# EAGLE schematic Motherboard (EAGLE 9.6.2)

## Sheet 1 of 2
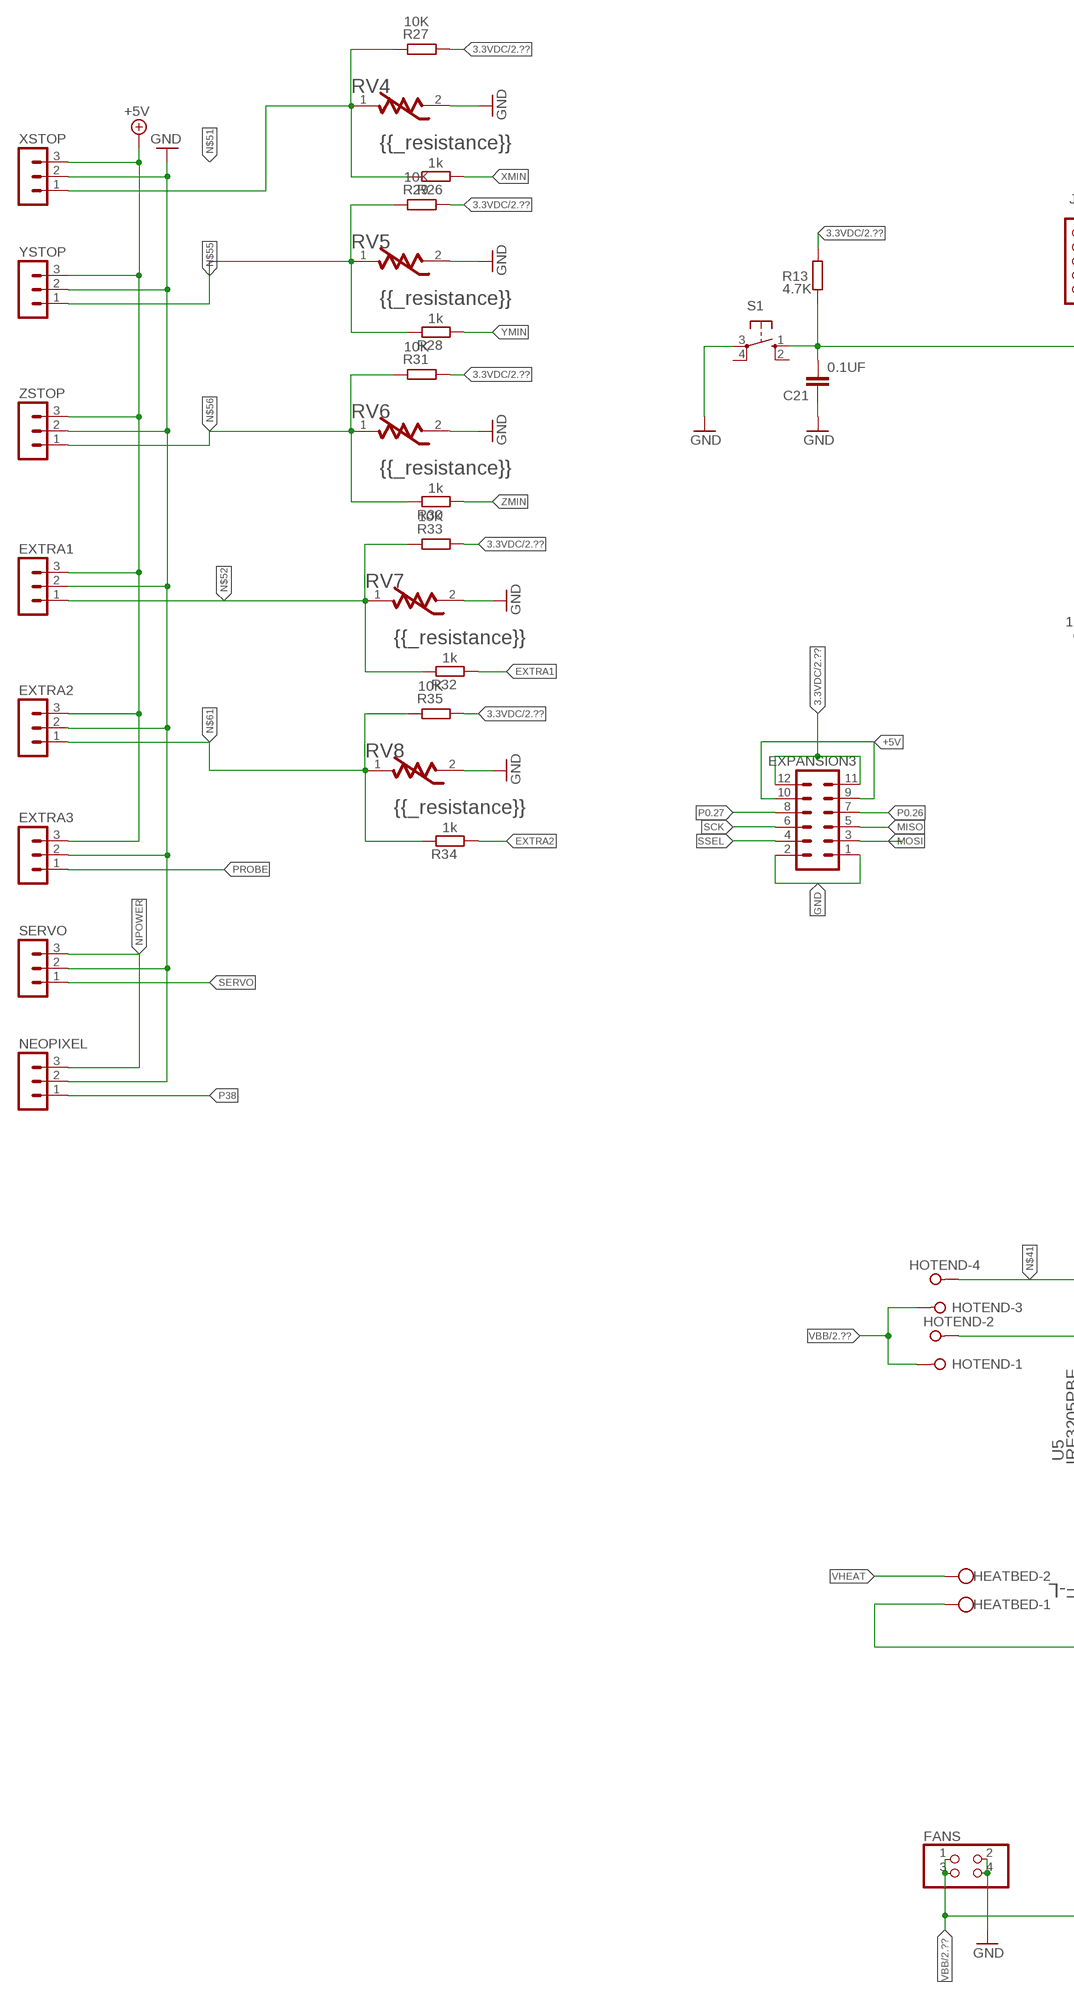
[diagram p0: schematic, sheet 1, part 1 of 2]
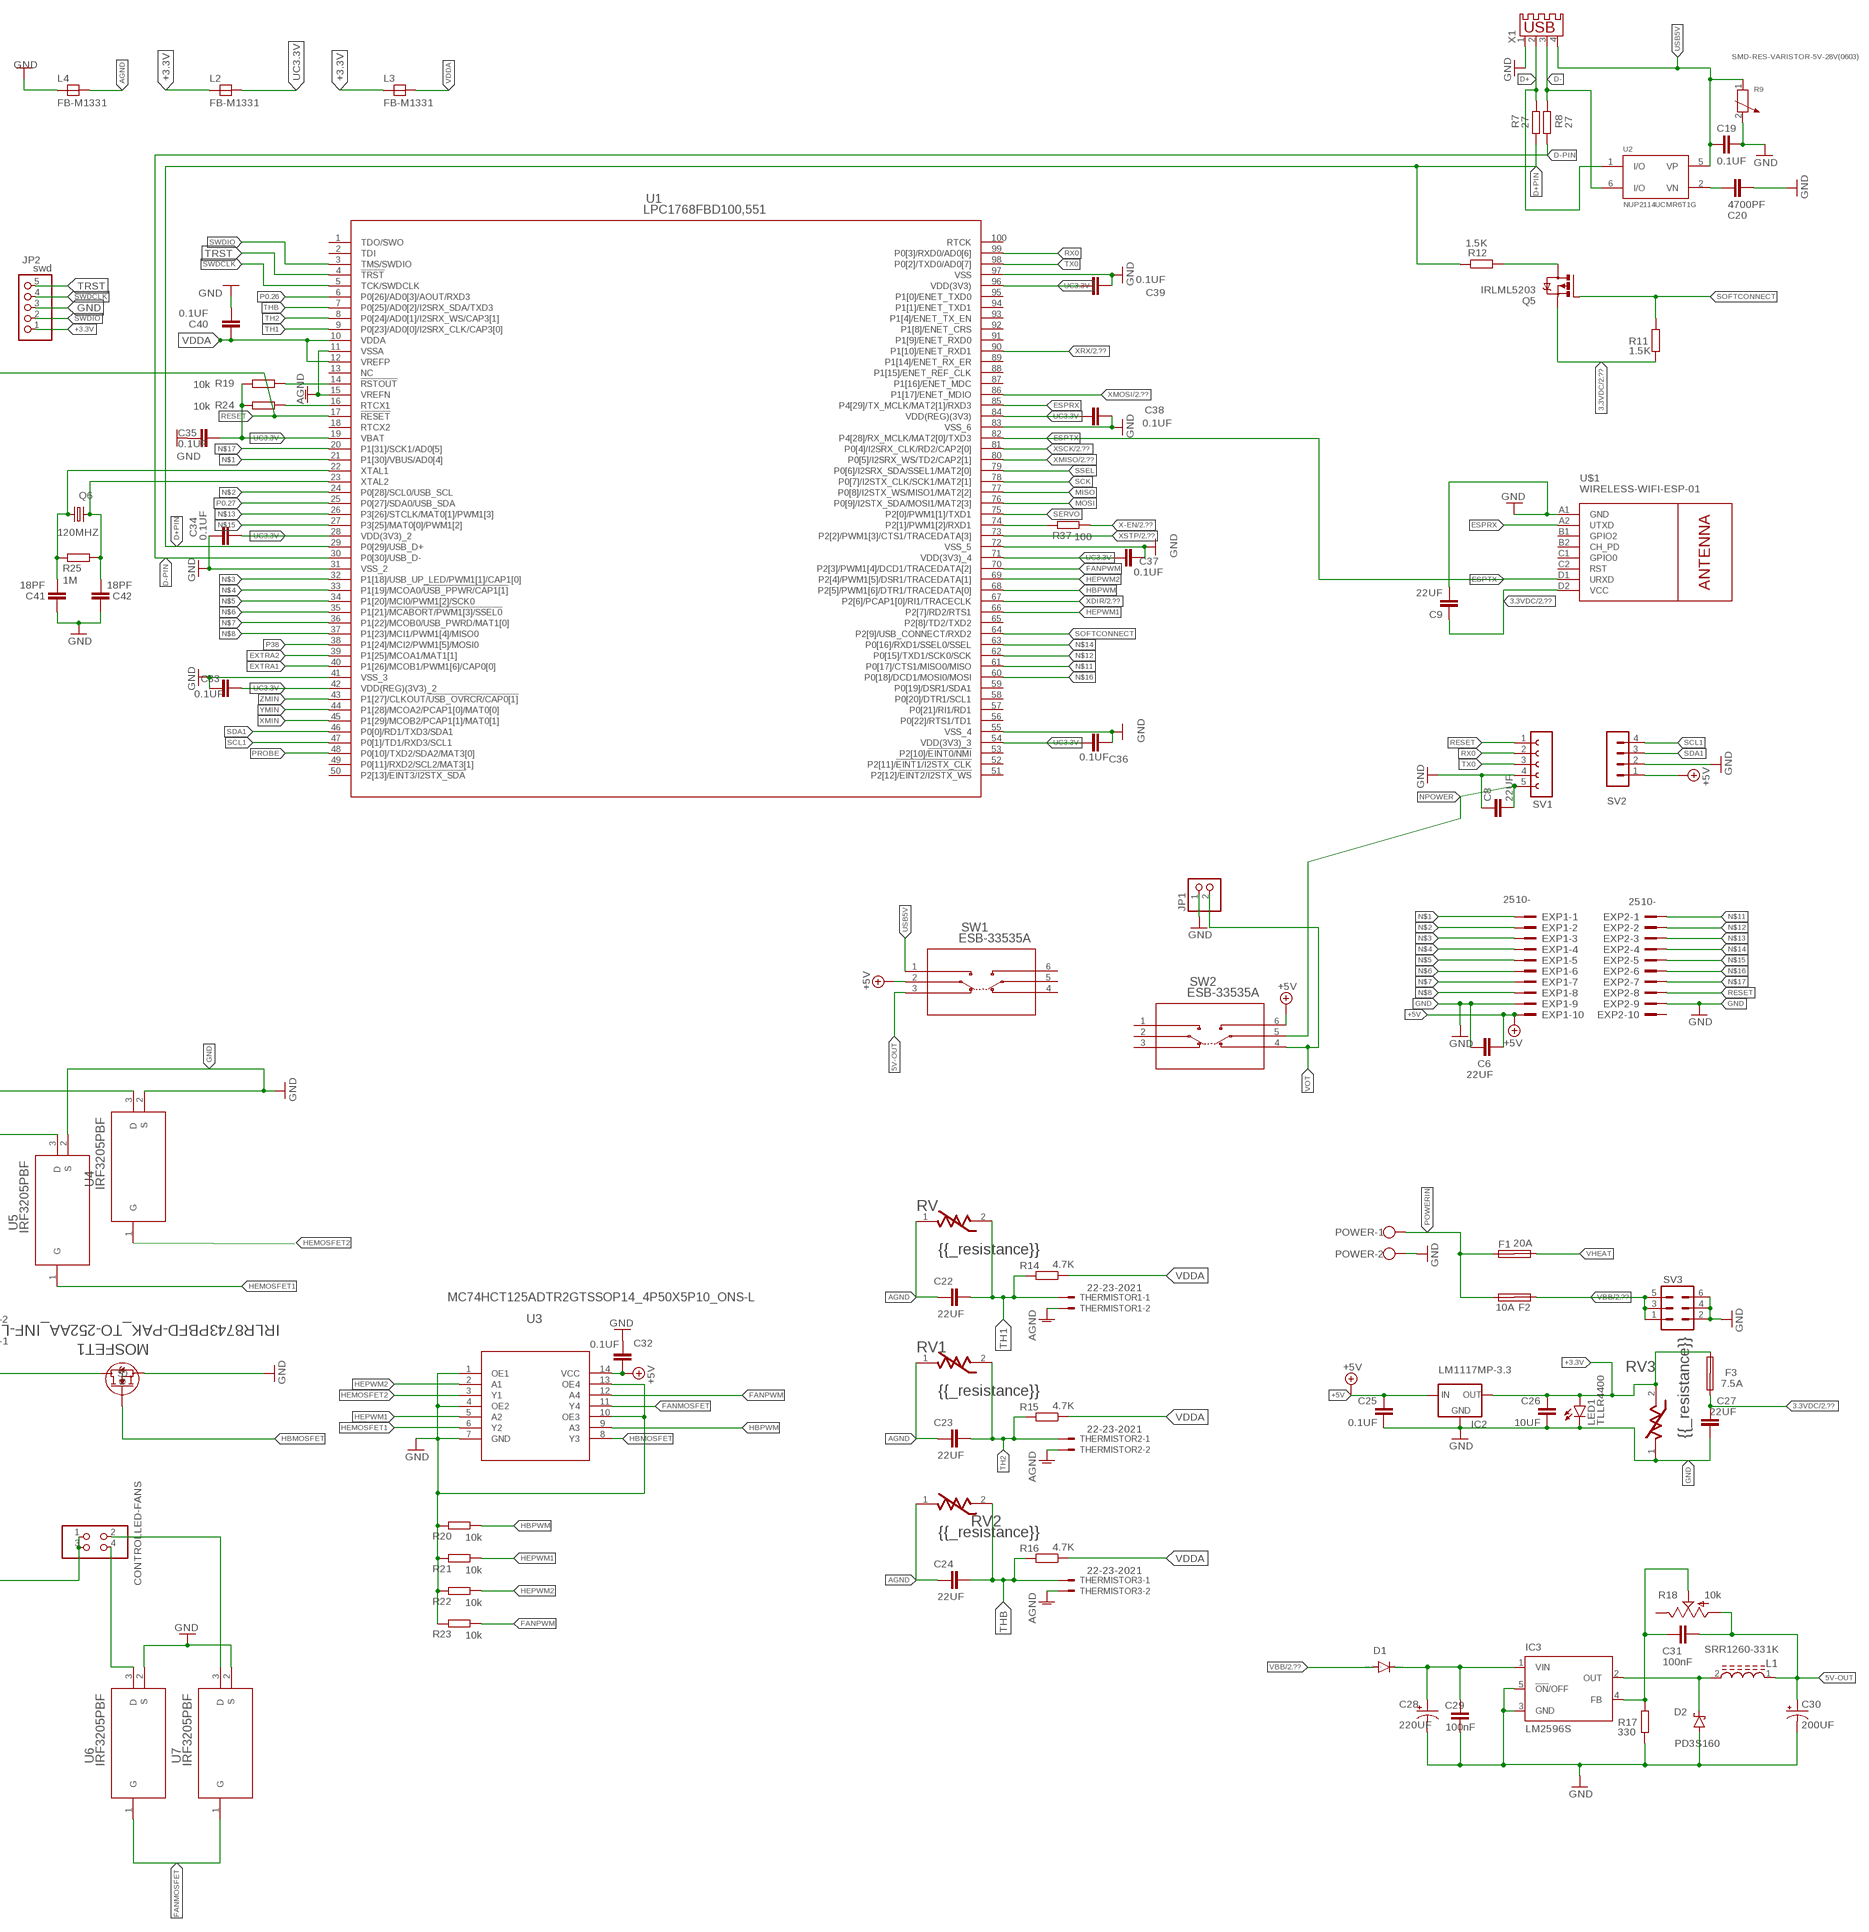
[diagram p1: schematic, sheet 1, part 2 of 2]

### Parts
C6  22UF  C-EUC0805  [C0805]
C8  22UF  C-EUC0805  [C0805]
C9  22UF  C-EUC0805  [C0805]
C19  0.1UF  C-EUC0805  [C0805]
C20  4700PF  C-EUC0805  [C0805]
C21  0.1UF  C-EUC0805  [C0805]
C22  22UF  C-EUC0805  [C0805]
C23  22UF  C-EUC0805  [C0805]
C24  22UF  C-EUC0805  [C0805]
C25  0.1UF  C-EUC0805  [C0805]
C26  10UF  C-EUC0805  [C0805]
C27  22UF  C-EUC0805  [C0805]
C28  220UF  CPOL-USE5-10.5  [E5-10,5]
C29  100nF  C-EUC0805  [C0805]
C30  200UF  CPOL-USE5-10.5  [E5-10,5]
C31  100nF  C-EUC0805  [C0805]
C32  0.1UF  C-EUC0805  [C0805]
C33  0.1UF  C-EUC0805  [C0805]
C34  0.1UF  C-EUC0805  [C0805]
C35  0.1UF  C-EUC0805  [C0805]
C36  0.1UF  C-EUC0805  [C0805]
C37  0.1UF  C-EUC0805  [C0805]
C38  0.1UF  C-EUC0805  [C0805]
C39  0.1UF  C-EUC0805  [C0805]
C40  0.1UF  C-EUC0805  [C0805]
C41  18PF  C-EUC0805  [C0805]
C42  18PF  C-EUC0805  [C0805]
CONTROLLED-FANS  PINHD-2X2  [2X02]
D1  DIODE-DO214AA  [DO214AA]
D2  PD3S160  [POWERDI323]
EXP1  2510-  [PAK100/2500-10]
EXP2  2510-  [PAK100/2500-10]
EXPANSION3  MA06-2  [MA06-2]
EXTRA1  MA03-1  [MA03-1]
EXTRA2  MA03-1  [MA03-1]
EXTRA3  MA03-1  [MA03-1]
F1  20A  SHK20Q  [SHK20Q]
F2  10A  SHK20Q  [SHK20Q]
F3  7.5A  SHK20Q  [SHK20Q]
FANS  PINHD-2X2  [2X02]
HEATBED  W237-102  [W237-102]
HOTEND  W237-04P  [W237-4P]
IC2  LM1117MP-3.3  [SOT223]
IC3  LM2596S  [TO263-5]
JP1  PINHD-1X2  [1X02]
JP2  swd  PINHD-1X5  [1X05]
L1  SRR1260-331K  [INDP125125X600N]
L2  FB-M1331  [M1331]
L3  FB-M1331  [M1331]
L4  FB-M1331  [M1331]
LED1  TLLR4400  [LED3MM]
MOSFET1  IRLR8743PBFD-PAK_TO-252AA_INF-L  [D-PAK_TO-252AA_INF-L]
NEOPIXEL  MA03-1  [MA03-1]
POWER  W237-102  [W237-102]
Q5  IRLML5203  [MICRO3]
Q6  120MHZ  CRYSTALHC49S  [HC49/S]
R7  27  R-EU_R0805  [R0805]
R8  27  R-EU_R0805  [R0805]
R9  SMD-RES-VARISTOR-5V-28V(0603)  [R0603]
R11  1.5K  R-EU_R0805  [R0805]
R12  1.5K  R-EU_R0805  [R0805]
R13  4.7K  R-EU_R0805  [R0805]
R14  4.7K  R-EU_R0805  [R0805]
R15  4.7K  R-EU_R0805  [R0805]
R16  4.7K  R-EU_R0805  [R0805]
R17  330  R-EU_R0805  [R0805]
R18  10k  TRIM_US-B64Y  [B64Y]
R19  10k  R-EU_R0805  [R0805]
R20  10k  R-EU_R0805  [R0805]
R21  10k  R-EU_R0805  [R0805]
R22  10k  R-EU_R0805  [R0805]
R23  10k  R-EU_R0805  [R0805]
R24  10k  R-EU_R0805  [R0805]
R25  1M  R-EU_R0805  [R0805]
R26  1k  R-EU_R0805  [R0805]
R27  10K  R-EU_R0805  [R0805]
R28  1k  R-EU_R0805  [R0805]
R29  10K  R-EU_R0805  [R0805]
R30  1k  R-EU_R0805  [R0805]
R31  10K  R-EU_R0805  [R0805]
R32  1k  R-EU_R0805  [R0805]
R33  10K  R-EU_R0805  [R0805]
R34  1k  R-EU_R0805  [R0805]
R35  10K  R-EU_R0805  [R0805]
R37  100  R-EU_R0805  [R0805]
RV  BOURNS_INC._CG0603MLC-3.3LEBOURNS_INC._CG0603MLC-3.3LE_0_1  [BOURNS_INC._CG0603MLC-3.3LE_1]
RV1  BOURNS_INC._CG0603MLC-3.3LEBOURNS_INC._CG0603MLC-3.3LE_0_1  [BOURNS_INC._CG0603MLC-3.3LE_1]
RV2  BOURNS_INC._CG0603MLC-3.3LEBOURNS_INC._CG0603MLC-3.3LE_0_1  [BOURNS_INC._CG0603MLC-3.3LE_1]
RV3  BOURNS_INC._CG0603MLC-3.3LEBOURNS_INC._CG0603MLC-3.3LE_0_1  [BOURNS_INC._CG0603MLC-3.3LE_1]
RV4  BOURNS_INC._CG0603MLC-3.3LEBOURNS_INC._CG0603MLC-3.3LE_0_1  [BOURNS_INC._CG0603MLC-3.3LE_1]
RV5  BOURNS_INC._CG0603MLC-3.3LEBOURNS_INC._CG0603MLC-3.3LE_0_1  [BOURNS_INC._CG0603MLC-3.3LE_1]
RV6  BOURNS_INC._CG0603MLC-3.3LEBOURNS_INC._CG0603MLC-3.3LE_0_1  [BOURNS_INC._CG0603MLC-3.3LE_1]
RV7  BOURNS_INC._CG0603MLC-3.3LEBOURNS_INC._CG0603MLC-3.3LE_0_1  [BOURNS_INC._CG0603MLC-3.3LE_1]
RV8  BOURNS_INC._CG0603MLC-3.3LEBOURNS_INC._CG0603MLC-3.3LE_0_1  [BOURNS_INC._CG0603MLC-3.3LE_1]
S1  10-XX  [B3F-10XX]
SERVO  MA03-1  [MA03-1]
SV1  FE05-1  [FE05-1]
SV2  MA04-1  [MA04-1]
SV3  MA03-2  [MA03-2]
SW1  ESB-33535A  [ESB335_PAN]
SW2  ESB-33535A  [ESB335_PAN]
THERMISTOR1  22-23-2021  [22-23-2021]
THERMISTOR2  22-23-2021  [22-23-2021]
THERMISTOR3  22-23-2021  [22-23-2021]
U1  LPC1768FBD100,551  [LQFP100_14X14_NXP]
U2  NUP2114UCMR6T1G  [SOP95P275X110-6N]
U3  MC74HCT125ADTR2GTSSOP14_4P50X5P10_ONS-L  [TSSOP14_4P50X5P10_ONS-L]
U4  IRF3205PBF  [PG-TO220-3_INF]
U5  IRF3205PBF  [PG-TO220-3_INF]
U6  IRF3205PBF  [PG-TO220-3_INF]
U7  IRF3205PBF  [PG-TO220-3_INF]
U$1  WIRELESS-WIFI-ESP-01  [WIRELESS-WIFI-ESP-01]
X1  USB-A003  [USB-A003]
XSTOP  MA03-1  [MA03-1]
YSTOP  MA03-1  [MA03-1]
ZSTOP  MA03-1  [MA03-1]

### Nets
3.3VDC: C9.1 C27.1 EXPANSION3.11 EXPANSION3.12 F3.1A Q5.2(S) R11.2 R13.1 R27.2 R29.2 R31.2 R33.2 R35.2 U$1.D2(VCC) ; also sheet 2
5V-OUT: C30.+ C31.2 L1.1 R18.A SW1.3
+3.3V: C26.1 F3.2A IC2.2(OUT) IC2.4(OUT) JP2.1 L2.1 L3.1 LED1.A RV3.2
+5V: C6.1 C25.1 C32.2 EXP1.10 EXPANSION3.9 EXPANSION3.10 EXTRA1.3 EXTRA2.3 EXTRA3.3 IC2.3(IN) SV2.1 SW1.2 SW2.6 U3.14(VCC) XSTOP.3 YSTOP.3 ZSTOP.3
AGND: C22.1 C23.1 C24.1 L4.2 RV1.1 RV2.1 RV.1 THERMISTOR1.2 THERMISTOR2.2 THERMISTOR3.2 U1.11(VSSA) U1.15(VREFN)
D+: R7.2 U2.1(I/O) X1.2
D+PIN: R7.1 R12.1 U1.29(P0[29]/USB_D+)
D-: R8.2 U2.6(I/O) X1.3
D-PIN: R8.1 U1.30(P0[30]/USB_D-)
ESPRX: U1.85(P4[29]/TX_MCLK/MAT2[1]/RXD3) U$1.A2(UTXD)
ESPTX: U1.82(P4[28]/RX_MCLK/MAT2[0]/TXD3) U$1.D1(URXD)
EXTRA1: R32.2 U1.40(P1[26]/MCOB1/PWM1[6]/CAP0[0])
EXTRA2: R34.2 U1.39(P1[25]/MCOA1/MAT1[1])
FANMOSFET: U3.11(Y4) U6.1(G) U7.1(G)
FANPWM: R23.1 U1.70(P2[3]/PWM1[4]/DCD1/TRACEDATA[2]) U3.12(A4)
GND: C6.2 C8.1 C9.2 C19.1 C20.1 C21.2 C25.2 C26.2 C27.2 C28.- C29.2 C30.- C32.1 C33.1 C34.1 C35.1 C36.1 C37.1 C38.1 C39.1 C40.2 C41.1 C42.1 D2.A EXP1.9 EXP2.9 EXPANSION3.1 EXPANSION3.2 EXTRA1.2 EXTRA2.2 EXTRA3.2 FANS.2 FANS.4 IC2.1(GND) IC3.3(GND) IC3.5(!ON!/OFF) JP1.1 JP2.3 L4.1 LED1.K(C) MOSFET1.3(S) NEOPIXEL.2 POWER.2 R9.2 R17.2 R20.2 R21.2 R22.2 R23.2 RV3.1 RV4.2 RV5.2 RV6.2 RV7.2 RV8.2 S1.3(P) SERVO.2 SV1.4 SV2.2 SV3.2 SV3.4 SV3.6 U1.31(VSS_2) U1.41(VSS_3) U1.55(VSS_4) U1.72(VSS_5) U1.83(VSS_6) U1.97(VSS) U3.1(OE1) U3.4(OE2) U3.7(GND) U3.10(OE3) U3.13(OE4) U4.2(S) U5.2(S) U6.2(S) U7.2(S) U$1.A1(GND) X1.1 XSTOP.2 YSTOP.2 ZSTOP.2 ; also sheet 2
HBMOSFET: MOSFET1.1(G) U3.8(Y3)
HBPWM: R20.1 U1.68(P2[5]/PWM1[6]/DTR1/TRACEDATA[0]) U3.9(A3)
HEMOSFET1: U3.6(Y2) U5.1(G)
HEMOSFET2: U3.3(Y1) U4.1(G)
HEPWM1: R21.1 U1.66(P2[7]/RD2/RTS1) U3.5(A2)
HEPWM2: R22.1 U1.69(P2[4]/PWM1[5]/DSR1/TRACEDATA[1]) U3.2(A1)
MISO: EXPANSION3.5 U1.77(P0[8]/I2STX_WS/MISO1/MAT2[2])
MOSI: EXPANSION3.3 U1.76(P0[9]/I2STX_SDA/MOSI1/MAT2[3])
N$1: EXP1.1 U1.21(P1[30]/VBUS/AD0[4])
N$2: EXP1.2 U1.24(P0[28]/SCL0/USB_SCL)
N$3: EXP1.3 U1.32(P1[18]/USB_UP_LED/PWM1[1]/CAP1[0])
N$4: EXP1.4 U1.33(P1[19]/MCOA0/!USB_PPWR/CAP1[1])
N$5: EXP1.5 U1.34(P1[20]/MCI0/PWM1[2]/SCK0)
N$6: EXP1.6 U1.35(P1[21]/!MCABORT/PWM1[3]/SSEL0)
N$7: EXP1.7 U1.36(P1[22]/MCOB0/USB_PWRD/MAT1[0])
N$8: EXP1.8 U1.37(P1[23]/MCI1/PWM1[4]/MISO0)
N$11: EXP2.1 U1.61(P0[17]/CTS1/MISO0/MISO)
N$12: EXP2.2 U1.62(P0[15]/TXD1/SCK0/SCK)
N$13: EXP2.3 U1.26(P3[26]/STCLK/MAT0[1]/PWM1[3])
N$14: EXP2.4 U1.63(P0[16]/RXD1/SSEL0/SSEL)
N$15: EXP2.5 U1.27(P3[25]/MAT0[0]/PWM1[2])
N$16: EXP2.6 U1.60(P0[18]/DCD1/MOSI0/MOSI)
N$17: EXP2.7 U1.20(P1[31]/SCK1/AD0[5])
N$22: R37.2 U1.74(P2[1]/PWM1[2]/RXD1)
N$34: C20.2 U2.2(VN)
N$35: HEATBED.1 MOSFET1.2(D)
N$36: Q5.3(D) R12.2
N$37: C31.1 IC3.4(FB) R17.1 R18.S
N$38: C28.+ C29.1 D1.C IC3.1(VIN)
N$39: D2.C IC3.2(OUT) L1.2
N$40: CONTROLLED-FANS.4 U6.3(D)
N$41: HOTEND.4 U4.3(D)
N$42: HOTEND.2 U5.3(D)
N$43: CONTROLLED-FANS.2 U7.3(D)
N$44: R19.1 U1.14(!RSTOUT)
N$45: R24.1 U1.16(RTCX1)
N$46: C41.2 Q6.1 R25.2 U1.22(XTAL1)
N$47: C42.2 Q6.2 R25.1 U1.23(XTAL2)
N$51: R26.1 R27.1 RV4.1 XSTOP.1
N$52: EXTRA1.1 R32.1 R33.1 RV7.1
N$55: R28.1 R29.1 RV5.1 YSTOP.1
N$56: R30.1 R31.1 RV6.1 ZSTOP.1
N$61: EXTRA2.1 R34.1 R35.1 RV8.1
NPOWER: C8.2 NEOPIXEL.3 SERVO.3 SV1.5 SW2.5
P0.26: EXPANSION3.7 U1.6(P0[26]/AD0[3]/AOUT/RXD3)
P0.27: EXPANSION3.8 U1.25(P0[27]/SDA0/USB_SDA)
P38: NEOPIXEL.1 U1.38(P1[24]/MCI2/PWM1[5]/MOSI0)
POWERIN: F1.1A F2.2A POWER.1
PROBE: EXTRA3.1 U1.48(P0[10]/TXD2/SDA2/MAT3[0])
RESET: C21.1 EXP2.8 R13.2 S1.1(S) SV1.1 U1.17(!RESET)
RX0: SV1.2 U1.99(P0[3]/RXD0/AD0[6])
SCK: EXPANSION3.6 U1.78(P0[7]/I2STX_CLK/SCK1/MAT2[1])
SCL1: SV2.4 U1.47(P0[1]/TD1/RXD3/SCL1)
SDA1: SV2.3 U1.46(P0[0]/RD1/TXD3/SDA1)
SERVO: SERVO.1 U1.75(P2[0]/PWM1[1]/TXD1)
SOFTCONNECT: Q5.1(G) R11.1 U1.64(P2[9]/USB_CONNECT/RXD2)
SSEL: EXPANSION3.4 U1.79(P0[6]/I2SRX_SDA/SSEL1/MAT2[0])
SWDCLK: JP2.4 U1.5(TCK/SWDCLK)
SWDIO: JP2.2 U1.3(TMS/SWDIO)
TH1: C22.2 R14.2 RV.2 THERMISTOR1.1 U1.9(P0[23]/AD0[0]/I2SRX_CLK/CAP3[0])
TH2: C23.2 R15.2 RV1.2 THERMISTOR2.1 U1.8(P0[24]/AD0[1]/I2SRX_WS/CAP3[1])
THB: C24.2 R16.2 RV2.2 THERMISTOR3.1 U1.7(P0[25]/AD0[2]/I2SRX_SDA/TXD3)
TRST: JP2.5 U1.4(!TRST)
TX0: SV1.3 U1.98(P0[2]/TXD0/AD0[7])
UC3.3V: C33.2 C34.2 C35.2 C36.2 C37.2 C38.2 C39.2 L2.2 R19.2 R24.2 U1.19(VBAT) U1.28(VDD(3V3)_2) U1.42(VDD(REG)(3V3)_2) U1.54(VDD(3V3)_3) U1.71(VDD(3V3)_4) U1.84(VDD(REG)(3V3)) U1.96(VDD(3V3))
USB5V: C19.2 R9.1 SW1.1 U2.5(VP) X1.4
VBB: CONTROLLED-FANS.1 CONTROLLED-FANS.3 D1.A F2.1A FANS.1 FANS.3 HOTEND.1 HOTEND.3 SV3.1 SV3.3 SV3.5 ; also sheet 2
VDDA: C40.1 L3.2 R14.1 R15.1 R16.1 U1.10(VDDA) U1.12(VREFP)
VHEAT: F1.2A HEATBED.2
VOT: JP1.2 SW2.4
X-EN: R37.1 ; also sheet 2
XDIR: U1.67(P2[6]/PCAP1[0]/RI1/TRACECLK) ; also sheet 2
XMIN: R26.2 U1.45(P1[29]/MCOB2/PCAP1[1]/MAT0[1])
XMISO: U1.80(P0[5]/I2SRX_WS/TD2/CAP2[1]) ; also sheet 2
XMOSI: U1.86(P1[17]/ENET_MDIO) ; also sheet 2
XRX: U1.90(P1[10]/ENET_RXD1) ; also sheet 2
XSCK: U1.81(P0[4]/I2SRX_CLK/RD2/CAP2[0]) ; also sheet 2
XSTP: U1.73(P2[2]/PWM1[3]/CTS1/TRACEDATA[3]) ; also sheet 2
YMIN: R28.2 U1.44(P1[28]/MCOA2/PCAP1[0]/MAT0[0])
ZMIN: R30.2 U1.43(P1[27]/CLKOUT/!USB_OVRCR/CAP0[1])
Unconnected: EXP2.10 F1.1B F1.2B F2.1B F2.2B F3.1B F3.2B R18.E S1.2(S1) S1.4(P1) SW1.4 SW1.5 SW1.6 SW2.1 SW2.2 SW2.3 U1.1(TDO/SWO) U1.2(TDI) U1.13(NC) U1.18(RTCX2) U1.49(P0[11]/RXD2/SCL2/MAT3[1]) U1.50(P2[13]/!EINT3/I2STX_SDA) U1.51(P2[12]/!EINT2/I2STX_WS) U1.52(P2[11]/!EINT1/I2STX_CLK) U1.53(P2[10]/!EINT0/NMI) U1.56(P0[22]/RTS1/TD1) U1.57(P0[21]/RI1/RD1) U1.58(P0[20]/DTR1/SCL1) U1.59(P0[19]/DSR1/SDA1) U1.65(P2[8]/TD2/TXD2) U1.87(P1[16]/ENET_MDC) U1.88(P1[15]/ENET_REF_CLK) U1.89(P1[14]/ENET_RX_ER) U1.91(P1[9]/ENET_RXD0) U1.92(P1[8]/ENET_CRS) U1.93(P1[4]/ENET_TX_EN) U1.94(P1[1]/ENET_TXD1) U1.95(P1[0]/ENET_TXD0) U1.100(RTCK) U$1.B1(GPIO2) U$1.B2(CH_PD) U$1.C1(GPIO0) U$1.C2(RST)

## Sheet 2 of 2
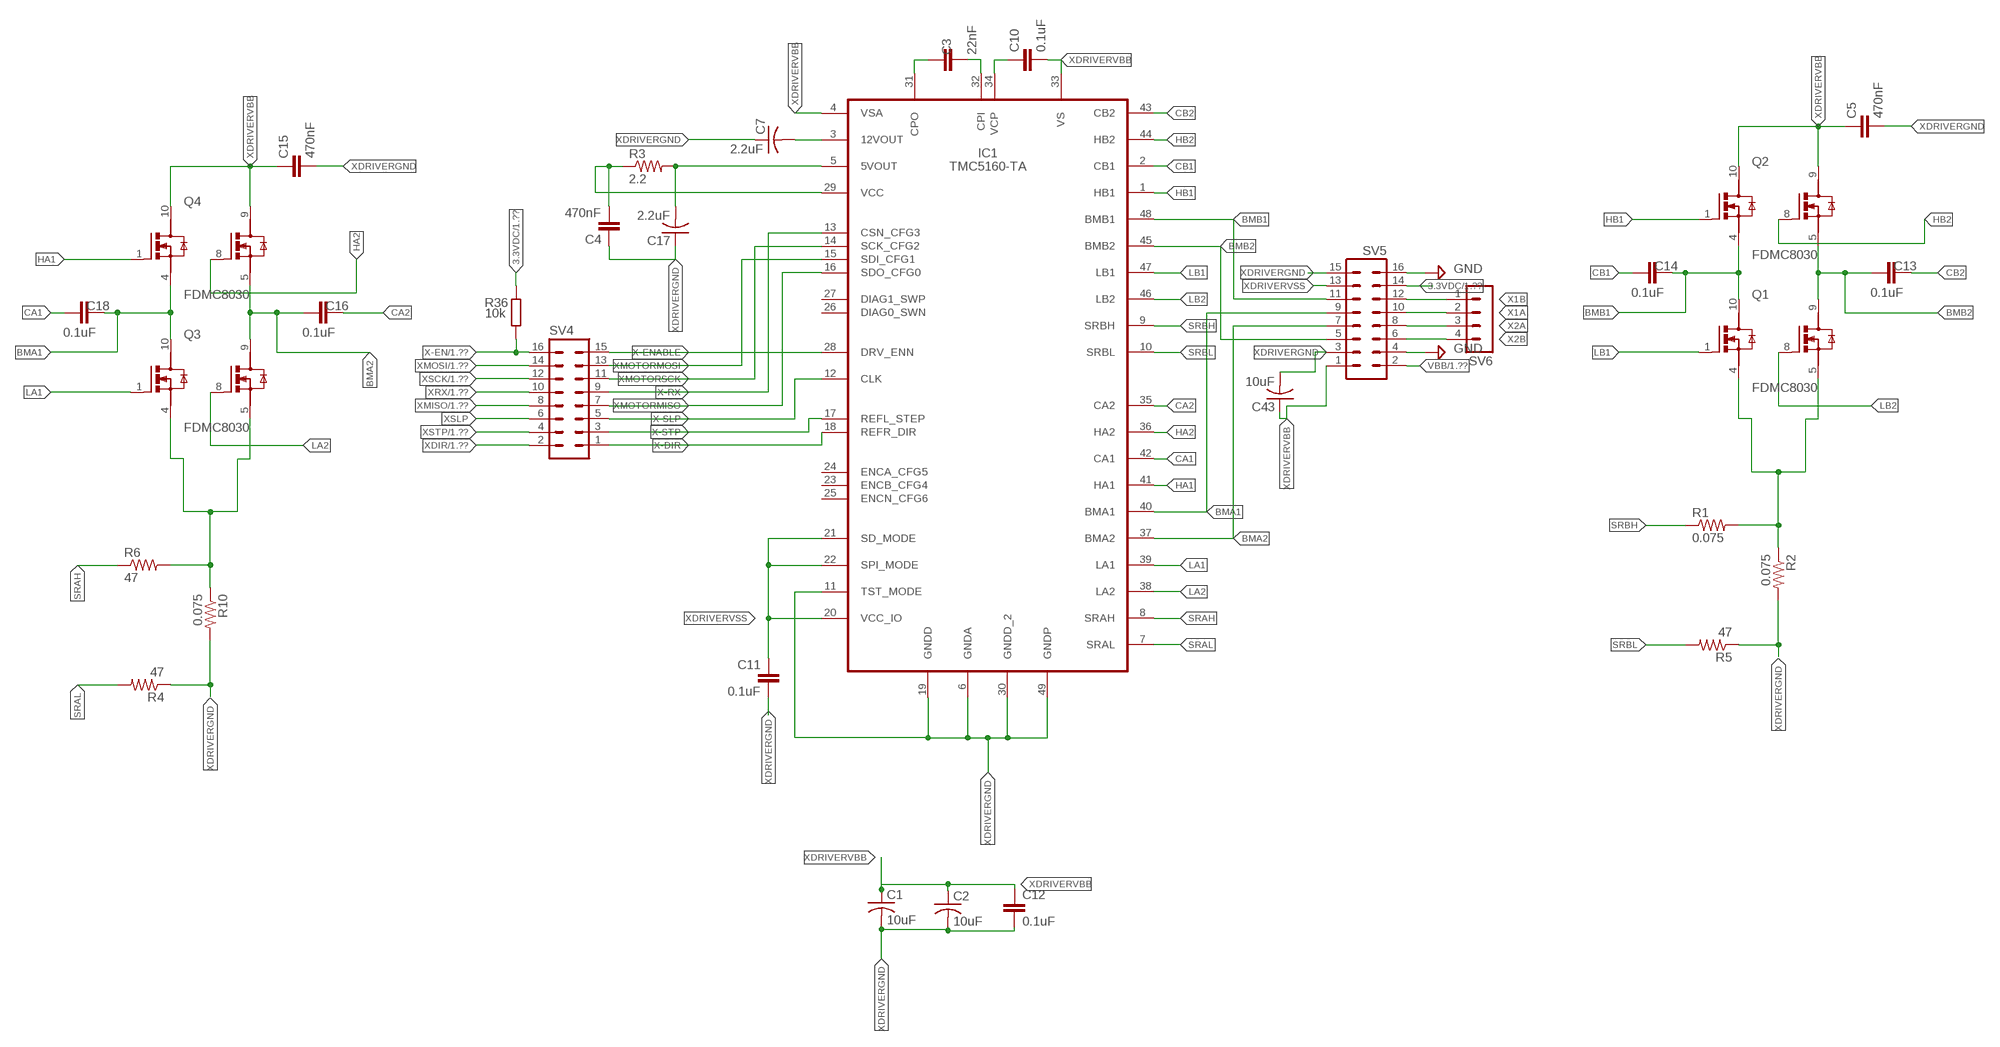
[diagram p2: schematic, sheet 2]

### Parts
C1  10uF  C-USC0805  [C0805]
C2  10uF  C-USC0805  [C0805]
C3  22nF  22NF/22,000PF-0603-50V-10%  [0603]
C4  470nF  470NF-0402-16V-10%  [0402]
C5  470nF  470NF-0402-16V-10%  [0402]
C7  2.2uF  C-USC0402  [C0402]
C10  0.1uF  0.1UF-0402-16V-10%  [0402]
C11  0.1uF  0.1UF-0402-16V-10%  [0402]
C12  0.1uF  0.1UF-0402-16V-10%  [0402]
C13  0.1uF  0.1UF-0402-16V-10%  [0402]
C14  0.1uF  0.1UF-0402-16V-10%  [0402]
C15  470nF  470NF-0402-16V-10%  [0402]
C16  0.1uF  0.1UF-0402-16V-10%  [0402]
C17  2.2uF  C-USC0402  [C0402]
C18  0.1uF  0.1UF-0402-16V-10%  [0402]
C43  10uF  C-USC0805  [C0805]
IC1  TMC5160-TA  [TQFP48-EP]
Q1  FDMC8030  [TRANS_FDMC8030]
Q2  FDMC8030  [TRANS_FDMC8030]
Q3  FDMC8030  [TRANS_FDMC8030]
Q4  FDMC8030  [TRANS_FDMC8030]
R1  0.075  R-US_R1206  [R1206]
R2  0.075  R-US_R1206  [R1206]
R3  2.2  R-US_R0402  [R0402]
R4  47  R-US_R0402  [R0402]
R5  47  R-US_R0402  [R0402]
R6  47  R-US_R0402  [R0402]
R10  0.075  R-US_R1206  [R1206]
R36  10k  R-EU_R0805  [R0805]
SV4  MA08-2  [MA08-2]
SV5  MA08-2  [MA08-2]
SV6  MA04-1  [MA04-1]

### Nets
3.3VDC: R36.1 SV5.14 ; also sheet 1
BMA1: C18.2 IC1.40(BMA1) Q3.10(D1) Q4.4(S1) SV5.9
BMA2: C16.1 IC1.37(BMA2) Q3.9(D2) Q4.5(S2) SV5.7
BMB1: C14.2 IC1.48(BMB1) Q1.10(D1) Q2.4(S1) SV5.11
BMB2: C13.1 IC1.45(BMB2) Q1.9(D2) Q2.5(S2) SV5.5
CA1: C18.1 IC1.42(CA1)
CA2: C16.2 IC1.35(CA2)
CB1: C14.1 IC1.2(CB1)
CB2: C13.2 IC1.43(CB2)
GND: SV5.4 SV5.16 ; also sheet 1
HA1: IC1.41(HA1) Q4.1(G1)
HA2: IC1.36(HA2) Q4.8(G2)
HB1: IC1.1(HB1) Q2.1(G1)
HB2: IC1.44(HB2) Q2.8(G2)
LA1: IC1.39(LA1) Q3.1(G1)
LA2: IC1.38(LA2) Q3.8(G2)
LB1: IC1.47(LB1) Q1.1(G1)
LB2: IC1.46(LB2) Q1.8(G2)
N$9: C10.1 IC1.34(VCP)
N$10: C3.1 IC1.31(CPO)
N$18: C3.2 IC1.32(CPI)
N$19: C7.2 IC1.3(12VOUT)
N$20: C17.2 IC1.5(5VOUT) R3.2
N$21: C4.2 IC1.29(VCC) R3.1
N$32: Q1.4(S1) Q1.5(S2) R1.2 R2.1
N$33: Q3.4(S1) Q3.5(S2) R6.2 R10.1
SRAH: IC1.8(SRAH) R6.1
SRAL: IC1.7(SRAL) R4.2
SRBH: IC1.9(SRBH) R1.1
SRBL: IC1.10(SRBL) R5.2
VBB: SV5.2 ; also sheet 1
X1A: SV5.10 SV6.2
X1B: SV5.12 SV6.1
X2A: SV5.8 SV6.3
X2B: SV5.6 SV6.4
X-DIR: IC1.18(REFR_DIR) SV4.1
X-EN: R36.2 SV4.16 ; also sheet 1
X-ENABLE: IC1.28(DRV_ENN) SV4.15
X-RX: IC1.13(CSN_CFG3) SV4.9
X-SLP: IC1.12(CLK) SV4.5
X-STP: IC1.17(REFL_STEP) SV4.3
XDIR: SV4.2 ; also sheet 1
XDRIVERGND: C1.2 C2.2 C4.1 C5.2 C7.1 C11.2 C12.2 C15.2 C17.1 C43.2 IC1.6(GNDA) IC1.11(TST_MODE) IC1.19(GNDD) IC1.30(GNDD_2) IC1.49(GNDP) R2.2 R4.1 R5.1 R10.2 SV5.3 SV5.15
XDRIVERVBB: C1.1 C2.1 C5.1 C10.2 C12.1 C15.1 C43.1 IC1.4(VSA) IC1.33(VS) Q2.9(D2) Q2.10(D1) Q4.9(D2) Q4.10(D1) SV5.1
XDRIVERVSS: C11.1 IC1.20(VCC_IO) IC1.21(SD_MODE) IC1.22(SPI_MODE) SV5.13
XMISO: SV4.8 ; also sheet 1
XMOSI: SV4.14 ; also sheet 1
XMOTORMISO: IC1.16(SDO_CFG0) SV4.7
XMOTORMOSI: IC1.15(SDI_CFG1) SV4.13
XMOTORSCK: IC1.14(SCK_CFG2) SV4.11
XRX: SV4.10 ; also sheet 1
XSCK: SV4.12 ; also sheet 1
XSLP: SV4.6
XSTP: SV4.4 ; also sheet 1
Unconnected: IC1.23(ENCB_CFG4) IC1.24(ENCA_CFG5) IC1.25(ENCN_CFG6) IC1.26(DIAG0_SWN) IC1.27(DIAG1_SWP)

## Library data of the parts
C1 C2 C7 C17 C43 = adafruit:C-US: CAPACITOR, American symbol
C3 = SparkFun-Capacitors:22NF/22,000PF: 0.022uF/22nF/22,000pF ceramic capacitors A capacitor is a passive two-terminal electrical component used to store electrical energy temporarily in an electric field.; PROD_ID: CAP-07885
C4 C5 C15 = SparkFun-Capacitors:470NF: 0.47uF/470nF ceramic capacitors A capacitor is a passive two-terminal electrical component used to store electrical energy temporarily in an electric field.; PROD_ID: CAP-09041
C6 C8 C9 C19-C27 C29 C31-C42 = rcl:C-EU: CAPACITOR, European symbol; SPICEPREFIX: C
C10-C14 C16 C18 = SparkFun-Capacitors:0.1UF: 0.1µF ceramic capacitors A capacitor is a passive two-terminal electrical component used to store electrical energy temporarily in an electric field.; PROD_ID: CAP-12416
C28 C30 = rcl:CPOL-US: POLARIZED CAPACITOR, American symbol; SPICEPREFIX: C
CONTROLLED-FANS FANS = pinhead:PINHD-2X2: PIN HEADER
D1 = diode:DIODE-: DIODE
D2 = diode:PD3S160: 1.0A SURFACE MOUNT SCHOTTKY BARRIER RECTIFIER POWERDI ® 323 Source: http://www.diodes.com/datasheets/ds30899.pdf
EXP1 EXP2 = con-3m:2510-: 3M (TM) Pak 100 4-Wall Header Source: 3M; MF: 3M; MPN: 2510-6002UB; OC_FARNELL: 9838244; OC_NEWARK: 46F4725
EXPANSION3 = con-lstb:MA06-2: PIN HEADER; OC_FARNELL: unknown; OC_NEWARK: unknown
EXTRA1-EXTRA3 NEOPIXEL SERVO XSTOP YSTOP ZSTOP = con-lstb:MA03-1: PIN HEADER; OC_FARNELL: unknown; OC_NEWARK: unknown
F1-F3 = fuse:SHK20Q: FUSE HOLDER 5 x 20 mm, SH contact, E1207 Buerklin 64G6061; OC_FARNELL: unknown; OC_NEWARK: unknown
HEATBED POWER = con-wago-500:W237-102: WAGO SCREW CLAMP; MPN: 237-102; OC_FARNELL: unknown; OC_NEWARK: 70K9898
HOTEND = con-wago-508:W237-04P: WAGO SREW CLAMP; OC_FARNELL: unknown; OC_NEWARK: unknown
IC1 = TMC5160-TA:TMC5160-TA: Universal high voltage controller for two-phase bipolar stepper motor. TQFP48-EP; AVAILABILITY: Unavailable; DESCRIPTION: Bipolar Motor Driver BCD MOS External Power MOSFETs SPI, Step/Direction 48-TQFP-EP _7x7_; MF: Trinamic Motion; MP: TMC5160-TA; PACKAGE: TQFP-48 Trinamic Motion; PRICE: None
IC2 = lm1117_10:LM1117?-*: 800mA Low-Dropout Linear Regulator Source: http://www.ti.com/lit/ds/symlink/lm1117-n.pdf; MF: Texas Instruments; MPN: LM1117MP-3.3; OC_FARNELL: 9778195; OC_NEWARK: 28X3416
IC3 = national-semiconductor:LM2596: SIMPLE SWITCHER® Power Converter 150 kHz 3A Step-Down Voltage Regulator Source: http://www.national.com/ds/LM/LM2596.pdf; MF: NATIONAL SEMICONDUCTOR; MPN: LM2596S-ADJ/NOPB; OC_FARNELL: 9494367; OC_NEWARK: 41K3842
JP1 = pinhead:PINHD-1X2: PIN HEADER
JP2 = pinhead:PINHD-1X5: PIN HEADER
L1 = SRR1260-331K:SRR1260-331K: Inductor Power Shielded Wirewound 33uH 20% 100KHz 27Q-Factor Ferrite 3A 60mOhm DCR T/R Buy Part <https://snapeda.com/parts/SRR1260-331K/Bourns/view-part/?ref=eda>; AVAILABILITY: Good; DESCRIPTION: 330µH Shielded Wirewound Inductor 1.15A 580mOhm Max Nonstandard; DIGIKEY-PURCHASE-URL: https://snapeda.com/shop?store=DigiKey&id=317881; MF: Bourns; MOUSER-PURCHASE-URL: https://snapeda.com/shop?store=Mouser&id=317881; MP: SRR1260-331K; PACKAGE: Nonstandard Bourns; PRICE: None
L2-L4 = inductors-jwmiller:FB: FERRITE BEAD
LED1 = led:TLLR4400: Low Current (2mA) LED 3 mm Tinted Diffused Package color RED Source: Data sheet <http://www.farnell.com/datasheets/391100.pdf>; MF: VISHAY SEMICONDUCTOR; OC_FARNELL: 1612437
MOSFET1 = IRLR8743:IRLR8743PBF; BUILT_BY: EMA_Cory; COPYRIGHT: Copyright (C) 2018 Accelerated Designs. All rights reserved; DATASHEET: https://www.infineon.com/dgdl/irlr8743pbf.pdf?fileId=5546d462533600a4015356719c7e26ff; MANUFACTURER_PART_NUMBER: IRLR8743PBF; SOURCELIBRARY: Infineon_2020-07-22; VENDOR: Infineon
Q1-Q4 = FDMC8030:FDMC8030: Dual N-Channel Power Trench® MOSFET 40 V, 12 A, 10 mΩ; AVAILABILITY: Unavailable; DESCRIPTION: Mosfet Array 2 N-Channel _Dual_ 40V 12A 800mW Surface Mount 8-Power33 _3x3_; MF: ON Semiconductor; MP: FDMC8030; PACKAGE: PowerWDFN-8 ON Semiconductor; PRICE: None
Q5 = transistor-power:IRLML5203: HEXFET P-Channel Power MOSFET
Q6 = crystal:CRYSTAL: CRYSTAL; OC_FARNELL: 1667008; OC_NEWARK: unknown
R1-R6 R10 = adafruit:R-US_: RESISTOR, American symbol
R7 R8 R11-R17 R19-R37 = rcl:R-EU_: RESISTOR, European symbol; SPICEPREFIX: R
R9 = SMD-RES-VARISTOR-5V-28V_0603_:SMD-RES-VARISTOR-5V-28V(0603): 314130003; DESCRIPTION: Varistor 1 Circuit Surface Mount, MLCV 0603 (1608 Metric); DIGI-KEY_PART_NUMBER: CG0603MLC-05ECT-ND; DIGIKEY-PURCHASE-URL: https://snapeda.com/shop?store=DigiKey&id=43960; MF: Bourns; MOUSER-PURCHASE-URL: https://snapeda.com/shop?store=Mouser&id=43960; MP: CG0603MLC-05E; PACKAGE: 0603 Bourns
R18 = pot:TRIM_US-: POTENTIOMETER
RV RV1-RV8 = Bourns Inc. - CG0603MLC-3.3LE:BOURNS_INC._CG0603MLC-3.3LE: Varistor 1 Circuit Surface Mount, MLCV 0603 (1608 Metric); AUTOMOTIVE: No; CAPACITANCE: 0.5pF; CENTROID_NOT_SPECIFIED: No; CLAMPING_VOLTAGE: 25V; DATASHEET: https://www.bourns.com/docs/Product-Datasheets/MLC.pdf; DEVICE_CLASS_L1: Circuit Protection; DEVICE_CLASS_L2: Varistors; DEVICE_CLASS_L3: unset; DIGIKEY_DESCRIPTION: RES VARISTOR 0603; DIGIKEY_PART_NUMBER: CG0603MLC-3.3LECT-ND; ESD_PROTEC_PRESENT: true; FOOTPRINT_PARAMETERS_1: {"fp_type":"chip_res","params":{"L":{"nom":1600000,"long name":"Length","min":1400000,"max":1800000,"short name":"L","type":"measurement"},"W":{"nom":800000,"long name":"Width","min":600000,"max":1000000,"short name":"W","type":"measurement"},"t":{"nom":450000,"long name":"Height","min":350000,"max":550000,"short name":"t","type":"measurement"},"b":{"nom":300000,"long name":"Terminal width","min":99999,"max":500000,"short name":"b","type":"measurement"},"P":{"default":"false","long name":"Polarized","type":"multichoice","short name":"P"},"offset x":{"nom":0,"long name":"X Center offset","min":null,"max":null,"short name":"offset x","type":"measurement"},"offset y":{"nom":0,"long name":"Y Center offset","min":null,"max":null,"short name":"offset y","type":"measurement"},"LS":{"long name":"Land shape","type":"fixed","short name":"LS","value":"Rectangle"},"solder toe":{"nom":550000,"long name":"Solder fillet (toe)","min":null,"max":null,"short name":"solder toe","type":"fixedmeasurement"},"solder heel":{"nom":0,"long name":"Solder fillet (heel)","min":null,"max":null,"short name":"solder heel","type":"fixedmeasurement"},"solder side":{"nom":50000,"long name":"Solder fillet (side)","min":null,"max":null,"short name":"solder side","type":"fixedmeasurement"},"courtyard":{"nom":500000,"long name":"Courtyard","min":null,"max":null,"short name":"courtyard","type":"fixedmeasurement"},"SF":{"default":"A (>= 1608 metric)","long name":"Packing level","type":"multichoiceparent","short name":"SF","help":"http://support.upverter.com/customer/portal/articles/978783-what-is-a-footprint-packing-level","children":["solder toe","solder heel","solder side","courtyard"]}}}; FOOTPRINT_PARAMETERS_2: {"fp_type":"chip_res","params":{"L":{"nom":1600000,"long name":"Length","min":1400000,"max":1800000,"short name":"L","type":"measurement"},"W":{"nom":800000,"long name":"Width","min":600000,"max":1000000,"short name":"W","type":"measurement"},"t":{"nom":450000,"long name":"Height","min":350000,"max":550000,"short name":"t","type":"measurement"},"b":{"nom":300000,"long name":"Terminal width","min":99999,"max":500000,"short name":"b","type":"measurement"},"P":{"default":"false","long name":"Polarized","type":"multichoice","short name":"P"},"offset x":{"nom":0,"long name":"X Center offset","min":null,"max":null,"short name":"offset x","type":"measurement"},"offset y":{"nom":0,"long name":"Y Center offset","min":null,"max":null,"short name":"offset y","type":"measurement"},"LS":{"long name":"Land shape","type":"fixed","short name":"LS","value":"Rectangle"},"solder toe":{"nom":350000,"long name":"Solder fillet (toe)","min":null,"max":null,"short name":"solder toe","type":"fixedmeasurement"},"solder heel":{"nom":0,"long name":"Solder fillet (heel)","min":null,"max":null,"short name":"solder heel","type":"fixedmeasurement"},"solder side":{"nom":0,"long name":"Solder fillet (side)","min":null,"max":null,"short name":"solder side","type":"fixedmeasurement"},"courtyard":{"nom":250000,"long name":"Courtyard","min":null,"max":null,"short name":"courtyard","type":"fixedmeasurement"},"SF":{"default":"B (>= 1608 metric)","long name":"Packing level","type":"multichoiceparent","short name":"SF","help":"http://support.upverter.com/customer/portal/articles/978783-what-is-a-footprint-packing-level","children":["solder toe","solder heel","solder side","courtyard"]}}}; FOOTPRINT_PARAMETERS_3: {"fp_type":"chip_res","params":{"L":{"nom":1600000,"long name":"Length","min":1400000,"max":1800000,"short name":"L","type":"measurement"},"W":{"nom":800000,"long name":"Width","min":600000,"max":1000000,"short name":"W","type":"measurement"},"t":{"nom":450000,"long name":"Height","min":350000,"max":550000,"short name":"t","type":"measurement"},"b":{"nom":300000,"long name":"Terminal width","min":99999,"max":500000,"short name":"b","type":"measurement"},"P":{"default":"false","long name":"Polarized","type":"multichoice","short name":"P"},"offset x":{"nom":0,"long name":"X Center offset","min":null,"max":null,"short name":"offset x","type":"measurement"},"offset y":{"nom":0,"long name":"Y Center offset","min":null,"max":null,"short name":"offset y","type":"measurement"},"LS":{"long name":"Land shape","type":"fixed","short name":"LS","value":"Rectangle"},"solder toe":{"nom":150000,"long name":"Solder fillet (toe)","min":null,"max":null,"short name":"solder toe","type":"fixedmeasurement"},"solder heel":{"nom":0,"long name":"Solder fillet (heel)","min":null,"max":null,"short name":"solder heel","type":"fixedmeasurement"},"solder side":{"nom":-50000,"long name":"Solder fillet (side)","min":null,"max":null,"short name":"solder side","type":"fixedmeasurement"},"courtyard":{"nom":100000,"long name":"Courtyard","min":null,"max":null,"short name":"courtyard","type":"fixedmeasurement"},"SF":{"default":"C (>= 1608 metric)","long name":"Packing level","type":"multichoiceparent","short name":"SF","help":"http://support.upverter.com/customer/portal/articles/978783-what-is-a-footprint-packing-level","children":["solder toe","solder heel","solder side","courtyard"]}}}; FOOTPRINT_VARIANT_NAME_0: Recommended_Land_Pattern; FOOTPRINT_VARIANT_NAME_1: IPC_A; FOOTPRINT_VARIANT_NAME_2: IPC_B; FOOTPRINT_VARIANT_NAME_3: IPC_C; HEIGHT: 0.55mm; IPC_LAND_PATTERN_NAME: RESC16080X45; LEAD_FREE: Yes; MF: Bourns Inc.; MFG_PACKAGE_IDENT: CG0603MLC; MFG_PACKAGE_IDENT_COMPONENT_ID: 6f7aec650cdc1335; MFG_PACKAGE_IDENT_DATE: 0; MFG_PACKAGE_IDENT_REV: 0; MOUSER_DESCRIPTION: ESD Suppressor Multilayer Varistor 3.3V 2-Pin Case 0603(1608Metric) T/R; MOUSER_PART_NUMBER: 652-CG0603MLC-3.3LE; MPN: CG0603MLC-3.3LE; PACKAGE: 0603; PREFIX: R; ROHS: Yes; TEMPERATURE_RANGE_HIGH: +85°C; TEMPERATURE_RANGE_LOW: -40°C; VERIFICATION_VERSION: 0.0.0.3; VOLTAGE_RATING_DC: 3.3V
S1 = switch-omron:10-XX: OMRON SWITCH; MPN: B3F-1000; OC_FARNELL: 176432; OC_NEWARK: 36M3542
SV1 = con-lsta:FE05-1: FEMALE HEADER; OC_FARNELL: unknown; OC_NEWARK: unknown
SV2 SV6 = con-lstb:MA04-1: PIN HEADER; OC_FARNELL: unknown; OC_NEWARK: unknown
SV3 = con-lstb:MA03-2: PIN HEADER; OC_FARNELL: unknown; OC_NEWARK: unknown
SV4 SV5 = con-lstb:MA08-2: PIN HEADER; OC_FARNELL: unknown; OC_NEWARK: unknown
SW1 SW2 = DPDTSwitch:ESB-33535A; BUILT_BY: EMA_Cory; COPYRIGHT: Copyright (C) 2018 Accelerated Designs. All rights reserved; DATASHEET: https://industrial.panasonic.com/ac/cdn/e/control/switch/push/catalog/sw_pu_eng_esb33.pdf; MANUFACTURER_PART_NUMBER: ESB-33535A; SOURCELIBRARY: Panasonic_2020-04-15; VENDOR: Panasonic
THERMISTOR1-THERMISTOR3 = con-molex:22-23-2021: .100" (2.54mm) Center Header - 2 Pin; MF: MOLEX; MPN: 22-23-2021; OC_FARNELL: 1462926; OC_NEWARK: 25C3832
U1 = LPC1768:LPC1768FBD100,551; BUILT_BY: EMA_Jessica; COPYRIGHT: Copyright (C) 2016 Accelerated Designs. All rights reserved; MANUFACTURER_PART_NUMBER: LPC1768FBD100,551; SOURCELIBRARY: NXP_2018-12-15; VENDOR: NXP
U2 = NUP2114UCMR6T1G:NUP2114UCMR6T1G: Uni Directional 10 V SMD ESD Protection Transient Voltage Suppressor - TSOP-6; DESCRIPTION: 10V (Typ) Clamp 8A (8/20µs) Ipp Tvs Diode Surface Mount 6-TSOP; DIGI-KEY_PART_NUMBER: NUP2114UCMR6T1GOSCT-ND; MF: ON Semiconductor; MP: NUP2114UCMR6T1G; PACKAGE: TSOP-6 ON Semiconductor
U3 = TriStateBuffer:MC74HCT125ADTR2G; COPYRIGHT: Copyright (C) 2016 Accelerated Designs. All rights reserved; MANUFACTURER_PART_NUMBER: MC74HCT125ADTR2G; SOURCELIBRARY: ONSemi_2017-12-12_5; VENDOR: ON Semiconductor
U4-U7 = IRF3205PBF:IRF3205PBF; BUILT_BY: EMA_UL_Team; COPYRIGHT: Copyright (C) 2018 Accelerated Designs. All rights reserved; MANUFACTURER_PART_NUMBER: IRF3205PBF; SOURCELIBRARY: Infineon_2019-12-20; VENDOR: Infineon
U$1 = ESP:WIRELESS-WIFI-ESP-01: Wireless Wi-Fi ESP-01 Module based on ESP8266 chip Click here to find device on ebay.com <http://www.ebay.com/sch/esp8266+esp+01+transceiver>
X1 = con-yamaichi:USB-A003: USB connector; OC_FARNELL: unknown; OC_NEWARK: unknown